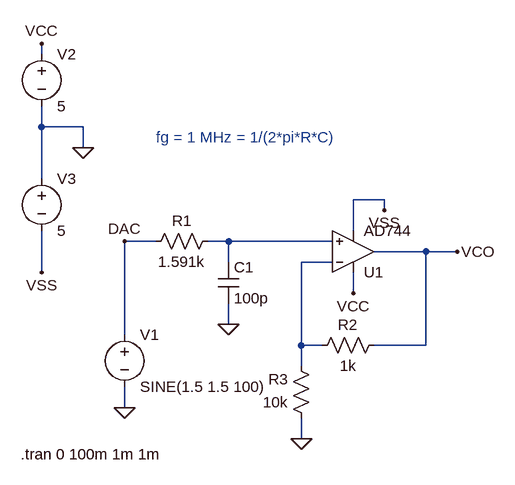
[diagram p0: schematic VCO_amp.asc]
VCO_amp.asc, the LTspice schematic file:
Version 4.1
SHEET 1 880 680
WIRE -48 -336 -48 -352
WIRE -48 -224 -48 -256
WIRE 16 -224 -48 -224
WIRE 16 -192 16 -224
WIRE -48 -144 -48 -224
WIRE 480 -112 432 -112
WIRE 480 -96 480 -112
WIRE 432 -64 432 -112
WIRE 128 -48 80 -48
WIRE 240 -48 208 -48
WIRE 400 -48 240 -48
WIRE 544 -32 464 -32
WIRE 592 -32 544 -32
WIRE 240 -16 240 -48
WIRE 400 -16 352 -16
WIRE -48 0 -48 -64
WIRE 432 32 432 0
WIRE 240 80 240 48
WIRE 80 96 80 -48
WIRE 352 112 352 -16
WIRE 384 112 352 112
WIRE 544 112 544 -32
WIRE 544 112 464 112
WIRE 352 144 352 112
WIRE 80 208 80 176
WIRE 352 256 352 224
FLAG 80 208 0
FLAG 240 80 0
FLAG 352 256 0
FLAG 16 -192 0
FLAG -48 -352 VCC
FLAG 80 -48 DAC
FLAG 432 32 VCC
FLAG 592 -32 VCO
FLAG -48 0 VSS
FLAG 480 -96 VSS
SYMBOL voltage 80 80 R0
WINDOW 123 0 0 Left 0
WINDOW 39 0 0 Left 0
SYMATTR InstName V1
SYMATTR Value SINE(1.5 1.5 100)
SYMBOL res 224 -64 R90
WINDOW 0 0 56 VBottom 2
WINDOW 3 32 56 VTop 2
SYMATTR InstName R1
SYMATTR Value 1.591k
SYMBOL cap 224 -16 R0
SYMATTR InstName C1
SYMATTR Value 100p
SYMBOL res 480 96 R90
WINDOW 0 0 56 VBottom 2
WINDOW 3 32 56 VTop 2
SYMATTR InstName R2
SYMATTR Value 1k
SYMBOL res 368 240 R180
WINDOW 0 36 76 Left 2
WINDOW 3 36 40 Left 2
SYMATTR InstName R3
SYMATTR Value 10k
SYMBOL voltage -48 -352 R0
WINDOW 123 0 0 Left 0
WINDOW 39 0 0 Left 0
SYMATTR InstName V2
SYMATTR Value 5
SYMBOL voltage -48 -160 R0
WINDOW 123 0 0 Left 0
WINDOW 39 0 0 Left 0
SYMATTR InstName V3
SYMATTR Value 5
SYMBOL OpAmps\\AD744 432 32 M180
SYMATTR InstName U1
TEXT 128 -208 Left 2 ;fg = 1 MHz = 1/(2*pi*R*C)
TEXT -80 280 Left 2 !.tran 0 100m 1m 1m

The netlist it stands for:
* VCO_amp.asc
V1 DAC 0 SINE(1.5 1.5 100)
R1 N001 DAC 1.591k
C1 N001 0 100p
R2 VCO N002 1k
R3 0 N002 10k
V2 VCC 0 5
V3 0 VSS 5
X§U1 N001 N002 VCC VSS VCO AD744  ; pins In+ In- V+ V- OUT
* fg = 1 MHz = 1/(2*pi*R*C)
.tran 0 100m 1m 1m
.backanno
.end